# Altium project christmas_tree.PrjPcb (part 2 of 2)

## Sheet additional_leds.SchDoc
size A4; DocumentNumber: 3; SheetNumber: 3; SheetTotal: 3
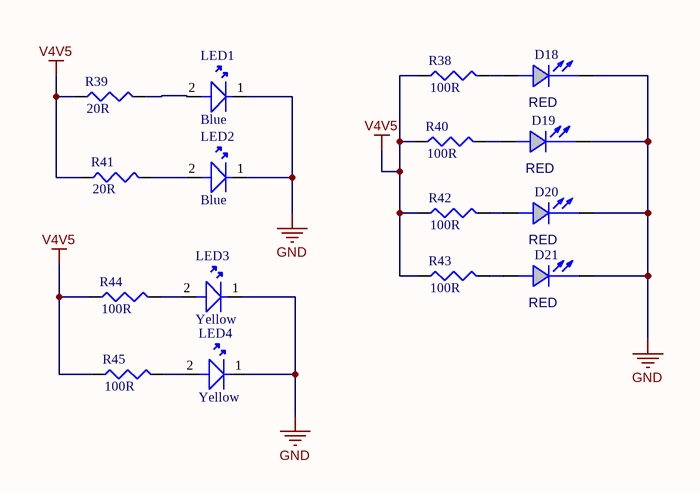
[diagram p2: additional_leds.SchDoc]

### Parts
D18  Colour: RED  [LEDC1608X40N]  (hidden comment: LED-0603)
D19  Colour: RED  [LEDC1608X40N]  (hidden comment: LED-0603)
D20  Colour: RED  [LEDC1608X40N]  (hidden comment: LED-0603)
D21  Colour: RED  [LEDC1608X40N]  (hidden comment: LED-0603)
LED1  Blue  [Type 3mm]
LED2  Blue  [Type 3mm]
LED3  Yellow  [Type 5mm]
LED4  Yellow  [Type 5mm]
R38  value 100R  [R0805]  (hidden comment: R0805)
R39  value 20R  [R0805]  (hidden comment: R0805)
R40  value 100R  [R0805]  (hidden comment: R0805)
R41  value 20R  [R0805]  (hidden comment: R0805)
R42  value 100R  [R0805]  (hidden comment: R0805)
R43  value 100R  [R0805]  (hidden comment: R0805)
R44  value 100R  [R0805]  (hidden comment: R0805)
R45  value 100R  [R0805]  (hidden comment: R0805)

### Nets
GND: D18.1(CATHODE) D19.1(CATHODE) D20.1(CATHODE) D21.1(CATHODE) LED1.1(K) LED2.1(K) LED3.1(K) LED4.1(K)
V4V5: R38.1 R39.1 R40.1 R41.1 R42.1 R43.1 R44.1 R45.1
NetD18_2: D18.2(ANODE) R38.2
NetD19_2: D19.2(ANODE) R40.2
NetD20_2: D20.2(ANODE) R42.2
NetD21_2: D21.2(ANODE) R43.2
NetLED1_2: LED1.2(A) R39.2
NetLED2_2: LED2.2(A) R41.2
NetLED3_2: LED3.2(A) R44.2
NetLED4_2: LED4.2(A) R45.2

### Notes on the sheet
- Name
- Code
- Page Name
- Drawn by
- Checked by
- Class
- Stage
- Date
- Status
- Reference No.
- Revision
- Page size
- ©
- Page No.
- Copyright
- www.firmwave.com
- Variant
- Firmwave
- ®
- of

### Library data of the parts
LED1 LED2 = WL-TMRW, Type 3mm, 151033BS03000: THT LED round mono-color waterclear, WL-TMRW , Blue; Manufacturer: Würth Elektronik eiSos GmbH; PartNo: 151033BS03000; ComponentLink1Description: Manufacturer; ComponentLink1URL: http://www.we-online.de; Created by: Christin Otto; Created Date: Oct-2014; ComponentLink2Description: Datasheet; ComponentLink2URL: http://katalog.we-online.de/pbs/datasheet/7448042001.pdfhttp://katalog.we-online.de/pbs/datasheet/7448042001.pdfhttp://katalog.we-online.de/pbs/datasheet/7448042001.pdfhttp://katalog.we-online.de/pbs/datasheet/151033BS03000.pdf; Emitting color: Blue
LED3 LED4 = WL-TMRW, Type 5mm, 151053BS04500: THT LED round mono-color waterclear, WL-TMRW ,Blue; Manufacturer: Würth Elektronik eiSos GmbH; PartNo: 151053BS04500; ComponentLink1Description: Manufacturer; ComponentLink1URL: http://www.we-online.de; Created by: Christin Otto; Created Date: Oct-2014; ComponentLink2Description: Datasheet; ComponentLink2URL: http://katalog.we-online.de/pbs/datasheet/7448042001.pdfhttp://katalog.we-online.de/pbs/datasheet/7448042001.pdfhttp://katalog.we-online.de/pbs/datasheet/7448042001.pdfhttp://katalog.we-online.de/pbs/datasheet/151053BS04500.pdf; Emitting color: Yellow
D18-D21 = LED-0603: PARTTYPE: LED_0603
R38-R45 = R0805: Published: 14-Jun-2016; LatestRevisionDate: 29-May-2009; LatestRevisionNote: IPC-7351 Footprint Added.; PackageReference: 0805; Publisher: Firmwave Limited; PackageDescription: Chip Resistor

## Nets that join several sheets
GND: driver_led (16 pins), mcu_power (70 pins), additional_leds (8 pins)
V3V3: driver_led (6 pins), mcu_power (21 pins)
V4V5: driver_led (56 pins), mcu_power (9 pins), additional_leds (8 pins)
NetR10_1: driver_led (U10.4 U11.4 U12.4), mcu_power (R10.1 R12.2 U1.14)
NetR14_2: driver_led (U10.3 U11.3 U12.3), mcu_power (R14.2 U1.15)
NetR46_1: driver_led (U10.21 U11.21 U12.21), mcu_power (R46.1 U1.18)
NetU1_16: driver_led (U10.22), mcu_power (U1.16)
NetU1_17: driver_led (U12.2), mcu_power (U1.17)